# Altium project Arduino gameboy.PrjPcb
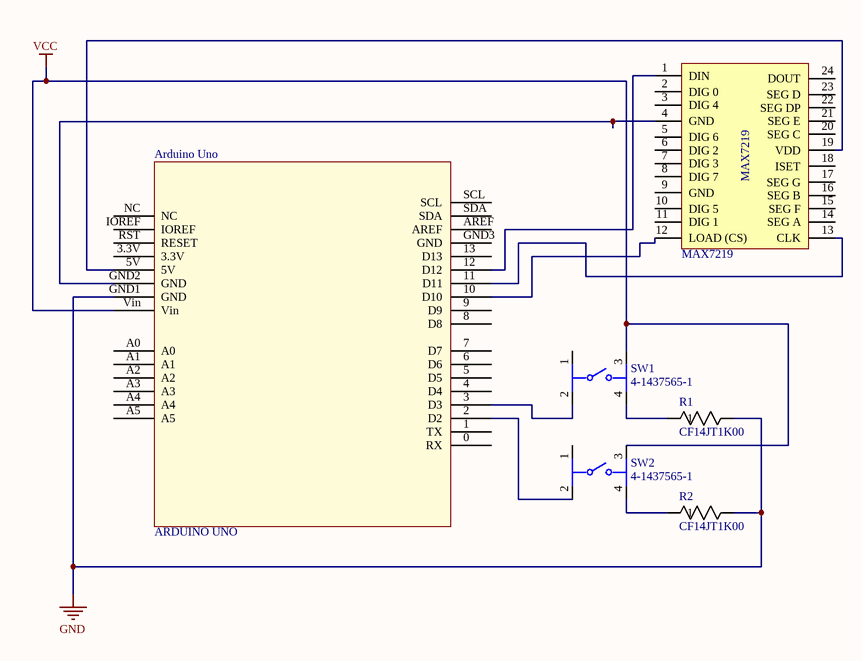
[diagram p0: schematic.SchDoc]
1 sheet, 6 parts. Net scope: global (net labels, ports and power ports of the same name join across sheets).
Board file: pcb.PcbDoc

## Sheet schematic.SchDoc
size A; SheetNumber: 1; SheetTotal: 1

### Parts
?  MAX7219
Arduino_Uno  ARDUINO UNO  [Arduino Uno]
R1  CF14JT1K00  [1k ohm]
R2  CF14JT1K00  [1k ohm]
SW1  4-1437565-1  [Push Button]
SW2  4-1437565-1  [Push Button]

### Nets
GND: Arduino_Uno.GND1(GND) R1.2 R2.2
VCC: Arduino_Uno.Vin SW1.3 SW2.3
Net?_1: ?.1(DIN) Arduino_Uno.12(D12)
Net?_4: ?.4(GND) Arduino_Uno.GND2(GND)
Net?_12: ?.12(LOAD_(CS)) Arduino_Uno.10(D10)
Net?_13: ?.13(CLK) Arduino_Uno.11(D11)
Net?_19: ?.19(VDD) Arduino_Uno.5V
NetArduino_Uno_2: Arduino_Uno.2(D2) SW2.2
NetArduino_Uno_3: Arduino_Uno.3(D3) SW1.2
NetR1_1: R1.1 SW1.4
NetR2_1: R2.1 SW2.4

Not connected (* = marked no-connect by the designer): ? 2(DIG_0) 3(DIG_4) 5(DIG_6) 6(DIG_2) 7(DIG_3) 8(DIG_7) 9(GND) 10(DIG_5) 11(DIG_1) 14(SEG_A) 15(SEG_F) 16(SEG_B) 17(SEG_G) 18(ISET) 20(SEG_C) 21(SEG_E) 22(SEG_DP) 23(SEG_D) 24(DOUT); Arduino_Uno 0(RX) 1(TX) 3.3V 4(D4) 5(D5) 6(D6) 7(D7) 8(D8) 9(D9) 13(D13) A0 A1 A2 A3 A4 A5 AREF GND3(GND) IOREF NC RST(RESET) SCL SDA; SW1 1; SW2 1

### Library data of the parts
R1 R2 = CF14JT1K00: Res Carbon Film 1K Ohm 5% 1/4W -400ppm/°C to 0ppm/°C Conformal AXL Thru-Hole T/R; Manufacturer: Stackpole Electronics; Supplier: Avnet; Supplier Part Number: CF14JT1K00; Manufacturer Part Number: CF14JT1K00; RoHS: Yes; Category: Through-Hole Resistors; Stock: 5000; Pricing: 5000=0.0063, 10000=0.00621, 20000=0.00612, 30000=0.00603, 40000=0.00594, 50000=0.00585, 500000=0.00576 (USD); ComponentLink1URL: http://components.arrow.com/part/dataview/27620077S9848643N1174?src-supplier=Arrow+Electronics; ComponentLink1Description: http://components.arrow.com/part/dataview/27620077S9848643N1174?src-supplier=Arrow+Electronics; ComponentLink2URL: https://www.seielect.com/catalog/SEI-CF_CFM.pdf?src-supplier=Avnet; ComponentLink2Description: https://www.seielect.com/catalog/SEI-CF_CFM.pdf?src-supplier=Avnet; ComponentLink3URL: https://www.seielect.com/catalog/SEI-Packaging.pdf?src-supplier=Digikey; ComponentLink3Description: https://www.seielect.com/catalog/SEI-Packaging.pdf?src-supplier=Digikey; ComponentLink4URL: https://www.seielect.com/Catalog/SEI-CF_CFM.pdf?src-supplier=Digikey; ComponentLink4Description: https://www.seielect.com/Catalog/SEI-CF_CFM.pdf?src-supplier=Digikey; ComponentLink5URL: http://www.seielect.com/Catalog/SEI-CF_CFM.pdf?src-supplier=Future+Electronics; ComponentLink5Description: http://www.seielect.com/Catalog/SEI-CF_CFM.pdf?src-supplier=Future+Electronics; ComponentLink6URL: https://www.verical.com/server-webapp/html/getDatasheet?partID=360403&src-supplier=Verical; ComponentLink6Description: https://www.verical.com/server-webapp/html/getDatasheet?partID=360403&src-supplier=Verical; ComponentLink7URL: https://datasheet.octopart.com/CF14JT1K00-Stackpole-Electronics-datasheet-8360004.pdf?src-supplier=Future+Electronics; ComponentLink7Description: https://datasheet.octopart.com/CF14JT1K00-Stackpole-Electronics-datasheet-8360004.pdf?src-supplier=Future+Electronics; ComponentLink8URL: https://datasheet.octopart.com/CF14JT1K00-Stackpole-Electronics-datasheet-32780772.pdf?src-supplier=Master+Electronics; ComponentLink8Description: https://datasheet.octopart.com/CF14JT1K00-Stackpole-Electronics-datasheet-32780772.pdf?src-supplier=Master+Electronics
SW1 SW2 = 4-1437565-1: Switch Tactile OFF (ON) SPST Round Button Gull Wing 0.05A 12VDC 1.57N SMD Loose Piece; Manufacturer: TE Connectivity; Actuator Material: 4302ConductorMaterial; Illumination Type: 4479,4480IlluminationType; Throw Configuration: 255Throw Configuration; Contact Current Rating: 50mA; Number of Positions: 2NUMBER; Switch Function: 6033SwitchFunction; Voltage Rating (DC): 24V; Contact Resistance: 100mR; Max Voltage Rating (DC): 12V; Switch Travel: 250um; Actuator Length: 1.397mm; Supplier: Rs; Supplier Part Number: 4791508P; Manufacturer Part Number: 4-1437565-1; RoHS: Yes; Category: Pushbutton Switches; Stock: 25850; Pricing: 200=0.193, 500=0.192, 1000=0.182, 2000=0.164 (GBP); Mounting Technology: 8Mount; Case/Package: 98Case; Color: 46Colour; Contact Material: 151ConductorMaterial; Contact Plating: 159ConductorMaterial; Min Operating Temperature: -35°C; Max Operating Temperature: 85°C; Packaging: 14Packaging; Termination: 4594ConnectorType; Current Rating: 50mA; Operating Force: 1.57N; Orientation: 5491OrientationType; Insulation Resistance: 100MR; Voltage Rating: 24V; Type: 6189ProductType; Length: 6mm; Width: 6mm; Height: 5.38mm; Reach SVHC Compliant: 4187SVHC; Lead Free: 5697LeadFree; ComponentLink1URL: https://datasheet.octopart.com/FSM4JSMA-Alcoswitch-datasheet-14569010.pdf?src-supplier=Newark; ComponentLink1Description: https://datasheet.octopart.com/FSM4JSMA-Alcoswitch-datasheet-14569010.pdf?src-supplier=Newark; ComponentLink2URL: https://datasheet.octopart.com/4-1437565-1-TE-Connectivity-datasheet-140613590.pdf?src-supplier=TME; ComponentLink2Description: https://datasheet.octopart.com/4-1437565-1-TE-Connectivity-datasheet-140613590.pdf?src-supplier=TME